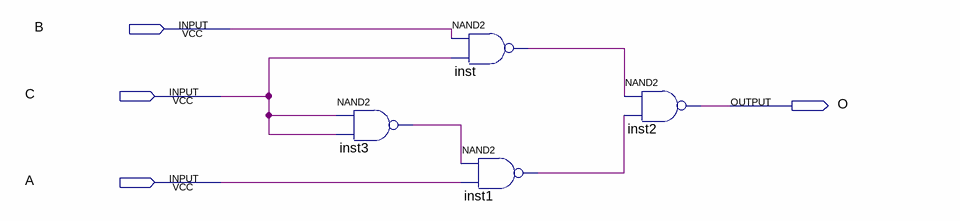
[diagram p0: schematic sheet]
// Quartus schematic Tutorial4.bdf as structural Verilog: 4 symbols, 4 pins
module Tutorial4 (
  input  B,
  input  C,
  input  A,
  output O
);

  wire inst1_out, inst3_out, inst_out;

  nand inst3 (inst3_out, C, C);
  nand inst (inst_out, B, C);
  nand inst1 (inst1_out, inst3_out, A);
  nand inst2 (O, inst_out, inst1_out);
endmodule
